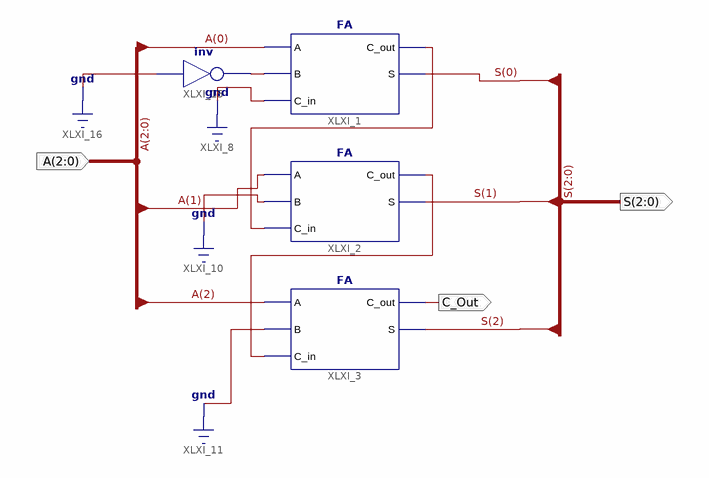
[diagram p0: schematic sheet 1]
// Xilinx ISE schematic Add_3.sch (spartan3e) as structural Verilog: 4 symbols, 3 ports
module Add_3 (
  input  [2:0] A,
  output C_Out,
  output [2:0] S
);

  wire XLXN_3, XLXN_5, XLXN_17;

  FA XLXI_1 (.A(A[0]), .B(XLXN_17), .C_in(1'b0), .C_out(XLXN_3), .S(S[0]));
  FA XLXI_2 (.A(A[1]), .B(1'b0), .C_in(XLXN_3), .C_out(XLXN_5), .S(S[1]));
  FA XLXI_3 (.A(A[2]), .B(1'b0), .C_in(XLXN_5), .C_out(C_Out), .S(S[2]));
  not XLXI_15 (XLXN_17, 1'b0);
endmodule
